# EAGLE design Test ADC (EAGLE 9.6.2)
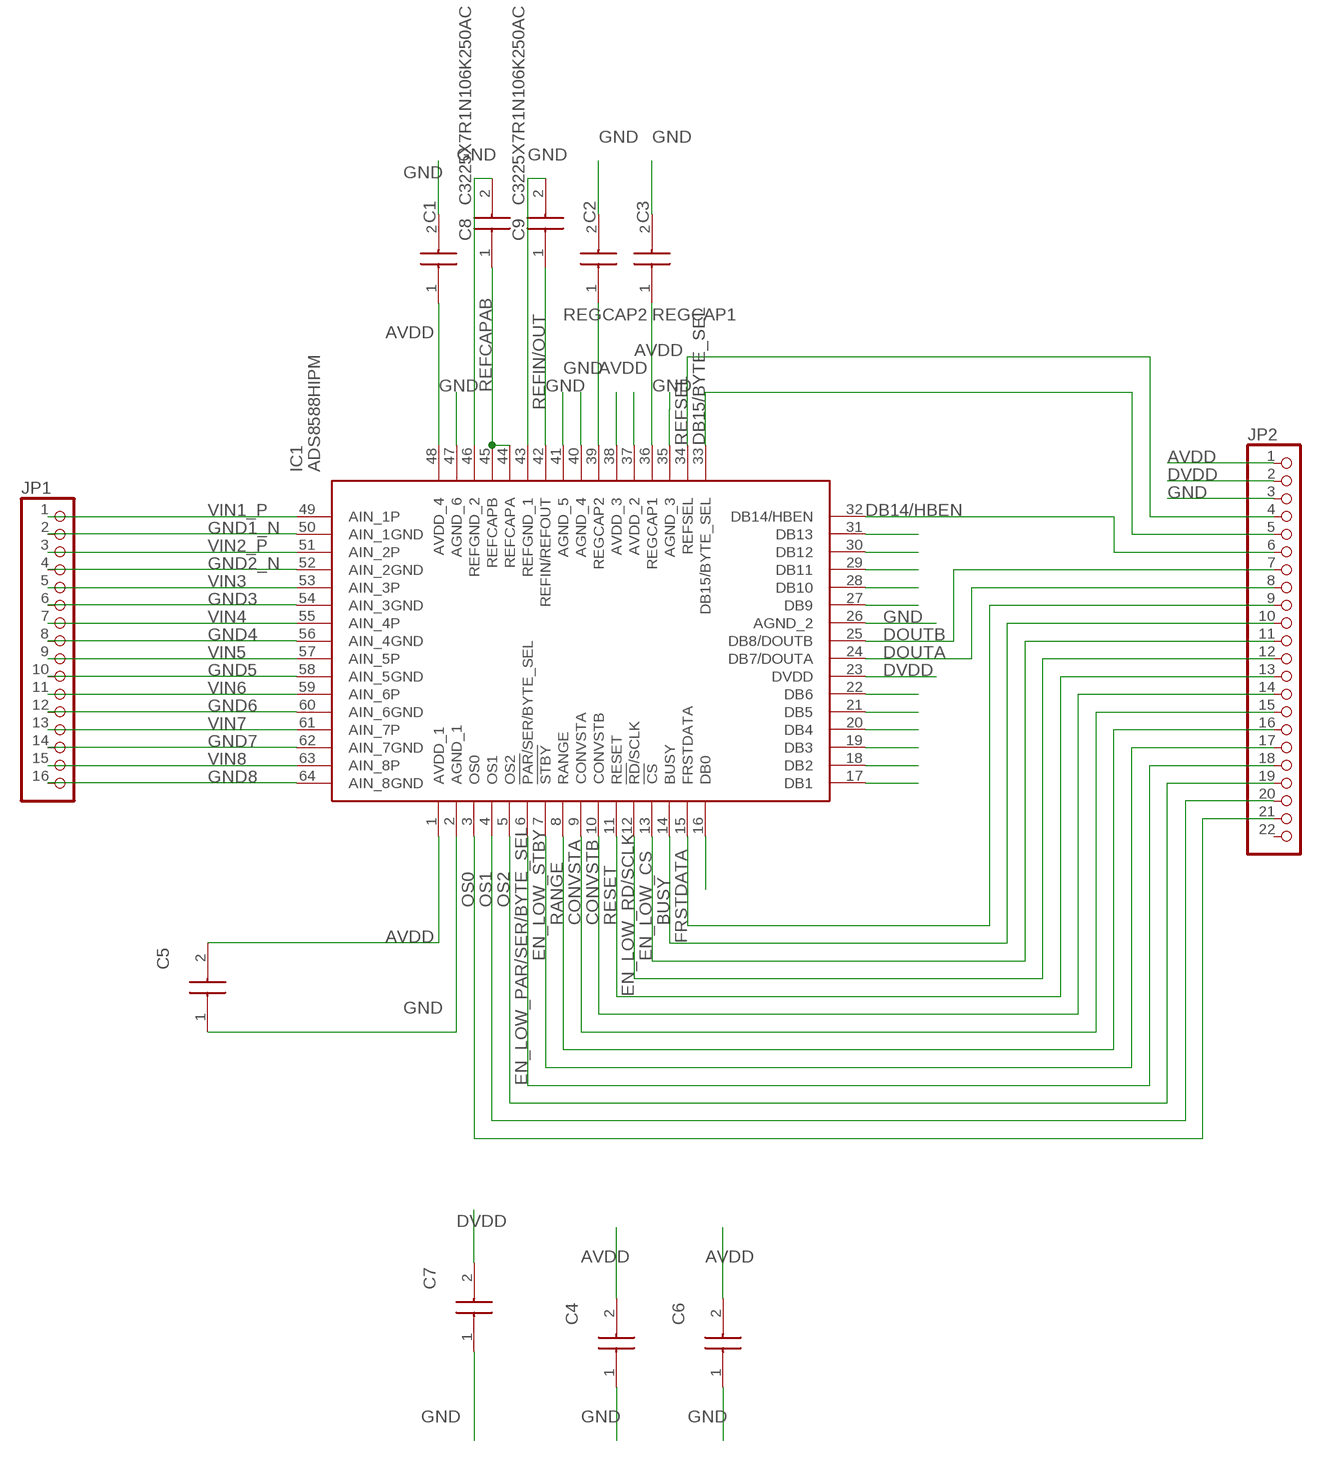
[diagram p0: schematic, sheet 1]

## Parts
C1  06033C105KAT4A  [CAPC1608X90N]
C2  06033C105KAT4A  [CAPC1608X90N]
C3  06033C105KAT4A  [CAPC1608X90N]
C4  06033C105KAT4A  [CAPC1608X90N]
C5  06033C105KAT4A  [CAPC1608X90N]
C6  06033C105KAT4A  [CAPC1608X90N]
C7  06033C105KAT4A  [CAPC1608X90N]
C8  C3225X7R1N106K250AC  [CAPC3225X230N]
C9  C3225X7R1N106K250AC  [CAPC3225X230N]
IC1  ADS8588HIPM  [QFP50P1200X1200X160-64N]
JP1  PINHD-1X16  [1X16]
JP2  PINHD-1X22  [1X22]

## Nets
AVDD: C1.1 C4.2 C5.2 C6.2 IC1.1(AVDD_1) IC1.37(AVDD_2) IC1.38(AVDD_3) IC1.48(AVDD_4) JP2.1
BUSY: IC1.14(BUSY) JP2.10
CONVSTA: IC1.9(CONVSTA) JP2.15
CONVSTB: IC1.10(CONVSTB) JP2.14
DB14/HBEN: IC1.32(DB14/HBEN) JP2.6
DB15/BYTE_SEL: IC1.33(DB15/BYTE_SEL) JP2.5
DOUTA: IC1.24(DB7/DOUTA) JP2.8
DOUTB: IC1.25(DB8/DOUTB) JP2.7
DVDD: C7.2 IC1.23(DVDD) JP2.2
EN_LOW_CS: IC1.13(!CS) JP2.11
EN_LOW_PAR/SER/BYTE_SEL: IC1.6(!PAR!/SER/BYTE_SEL) JP2.18
EN_LOW_RD/SCLK: IC1.12(!RD!/SCLK) JP2.12
EN_LOW_STBY: IC1.7(!STBY) JP2.17
FRSTDATA: IC1.15(FRSTDATA) JP2.9
GND: C1.2 C2.2 C3.2 C4.1 C5.1 C6.1 C7.1 C8.2 C9.2 IC1.2(AGND_1) IC1.26(AGND_2) IC1.35(AGND_3) IC1.40(AGND_4) IC1.41(AGND_5) IC1.43(REFGND_1) IC1.46(REFGND_2) IC1.47(AGND_6) JP2.3
GND1_N: IC1.50(AIN_1GND) JP1.2
GND2_N: IC1.52(AIN_2GND) JP1.4
GND3: IC1.54(AIN_3GND) JP1.6
GND4: IC1.56(AIN_4GND) JP1.8
GND5: IC1.58(AIN_5GND) JP1.10
GND6: IC1.60(AIN_6GND) JP1.12
GND7: IC1.62(AIN_7GND) JP1.14
GND8: IC1.64(AIN_8GND) JP1.16
N$1: IC1.31(DB13)
N$2: IC1.30(DB12)
N$3: IC1.29(DB11)
N$4: IC1.28(DB10)
N$5: IC1.27(DB9)
N$6: IC1.22(DB6)
N$7: IC1.21(DB5)
N$8: IC1.20(DB4)
N$9: IC1.19(DB3)
N$10: IC1.18(DB2)
N$11: IC1.17(DB1)
N$12: IC1.16(DB0)
OS0: IC1.3(OS0) JP2.21
OS1: IC1.4(OS1) JP2.20
OS2: IC1.5(OS2) JP2.19
RANGE: IC1.8(RANGE) JP2.16
REFCAPAB: C8.1 IC1.44(REFCAPA) IC1.45(REFCAPB)
REFIN/OUT: C9.1 IC1.42(REFIN/REFOUT)
REFSEL: IC1.34(REFSEL) JP2.4
REGCAP1: C3.1 IC1.36(REGCAP1)
REGCAP2: C2.1 IC1.39(REGCAP2)
RESET: IC1.11(RESET) JP2.13
VIN1_P: IC1.49(AIN_1P) JP1.1
VIN2_P: IC1.51(AIN_2P) JP1.3
VIN3: IC1.53(AIN_3P) JP1.5
VIN4: IC1.55(AIN_4P) JP1.7
VIN5: IC1.57(AIN_5P) JP1.9
VIN6: IC1.59(AIN_6P) JP1.11
VIN7: IC1.61(AIN_7P) JP1.13
VIN8: IC1.63(AIN_8P) JP1.15
Unconnected: JP2.22

## Library data of the parts
C1-C7 = SamacSys_Parts:06033C105KAT4A: Multilayer Ceramic Capacitors MLCC - SMD/SMT 25V 1uF X7R 0603 10%TOL Source: Datasheet <https://componentsearchengine.com/Datasheets/1/06031A100FAT2A.pdf>; DESCRIPTION: Multilayer Ceramic Capacitors MLCC - SMD/SMT 25V 1uF X7R 0603 10%TOL; HEIGHT: 0.9mm; MANUFACTURER_NAME: AVX; MANUFACTURER_PART_NUMBER: 06033C105KAT4A; MOUSER_PART_NUMBER: 581-06033C105KAT4A; MOUSER_PRICE-STOCK: https://www.mouser.co.uk/ProductDetail/AVX/06033C105KAT4A?qs=%252BdQmOuGyFcHIpI5MSreUwQ%3D%3D
C8 C9 = SamacSys_Parts:C3225X7R1N106K250AC: Multilayer Ceramic Capacitors MLCC - SMD/SMT 1210 75VDC 10uF 10% X7R Source: Datasheet <https://product.tdk.com/info/en/catalog/datasheets/mlcc_commercial_midvoltage_en.pdf>; DESCRIPTION: Multilayer Ceramic Capacitors MLCC - SMD/SMT 1210 75VDC 10uF 10% X7R; HEIGHT: 2.3mm; MANUFACTURER_NAME: TDK; MANUFACTURER_PART_NUMBER: C3225X7R1N106K250AC; MOUSER_PART_NUMBER: 810-C3225X7R1N106K25; MOUSER_PRICE-STOCK: https://www.mouser.co.uk/ProductDetail/TDK/C3225X7R1N106K250AC?qs=P1JMDcb91o5%2Fi%252BA2Vs0UoQ%3D%3D
IC1 = SamacSys_Parts:ADS8588HIPM: Analog to Digital Converters - ADC 16-Bit 500kSPS 8-Channel Simultaneous-Sampling ADC With Bipolar Inputs on a Single Supply 64-LQFP -40 to 125 Source: Datasheet <http://www.ti.com/lit/ds/symlink/ads8588h.pdf>; DESCRIPTION: Analog to Digital Converters - ADC 16-Bit 500kSPS 8-Channel Simultaneous-Sampling ADC With Bipolar Inputs on a Single Supply 64-LQFP -40 to 125; HEIGHT: 1.6mm; MANUFACTURER_NAME: Texas Instruments; MANUFACTURER_PART_NUMBER: ADS8588HIPM; MOUSER_PART_NUMBER: 595-ADS8588HIPM; MOUSER_PRICE-STOCK: https://www.mouser.co.uk/ProductDetail/Texas-Instruments/ADS8588HIPM?qs=1mbolxNpo8fD0GiY8NoIhA%3D%3D
JP1 = pinhead:PINHD-1X16: PIN HEADER
JP2 = pinhead:PINHD-1X22: PIN HEADER

## Board
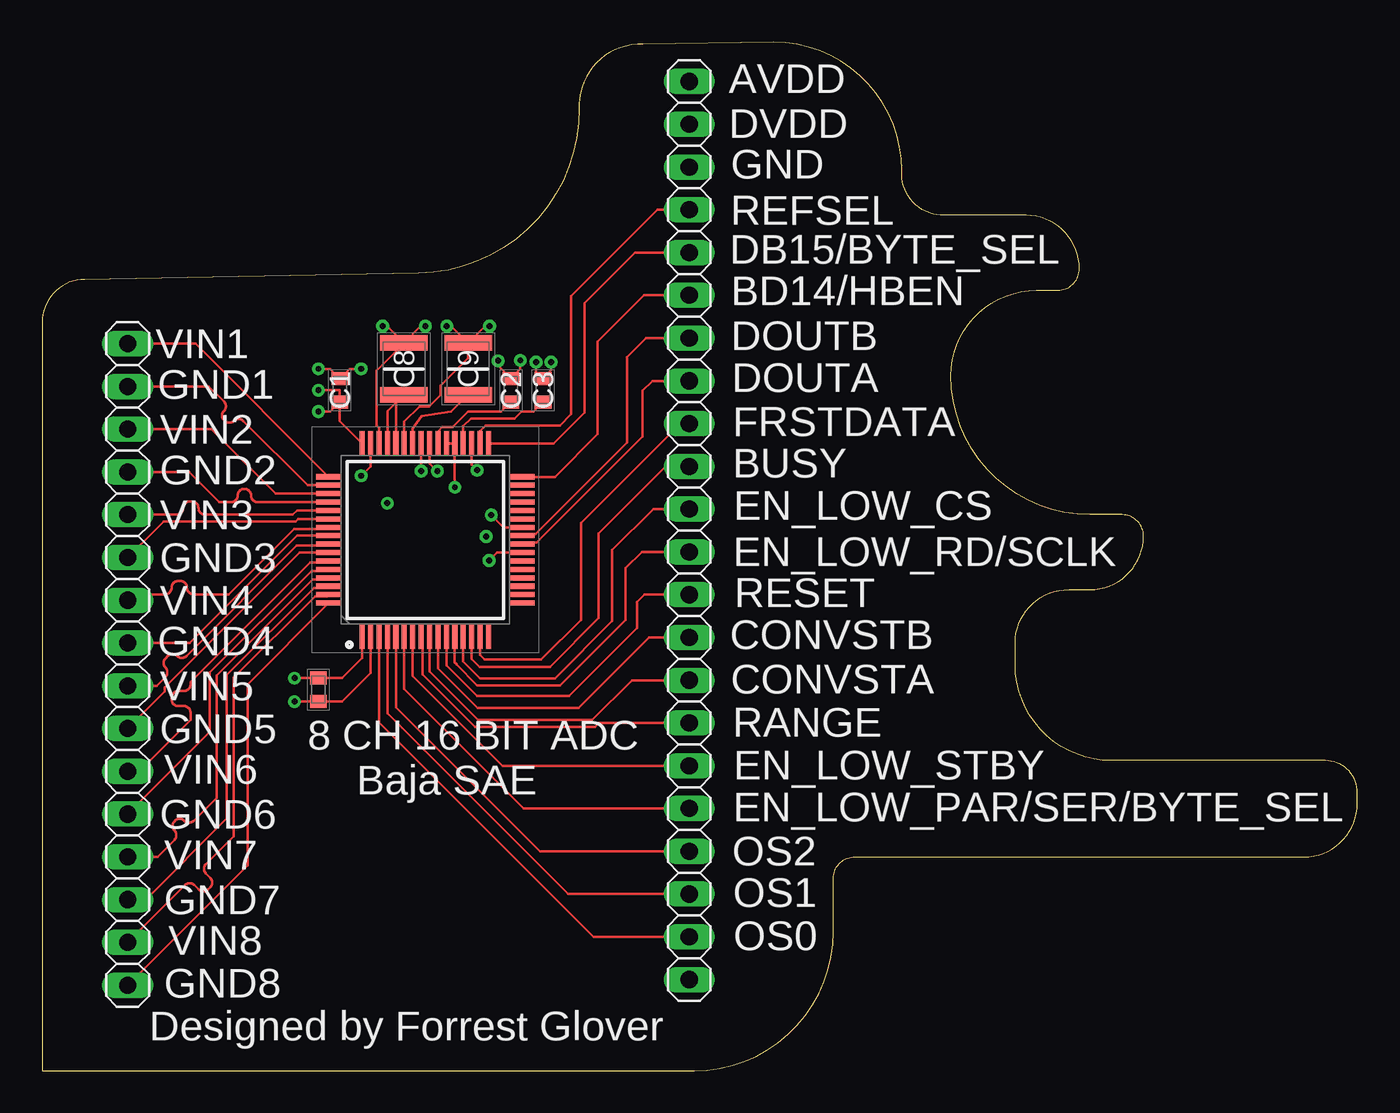
[diagram p1: board, top side]
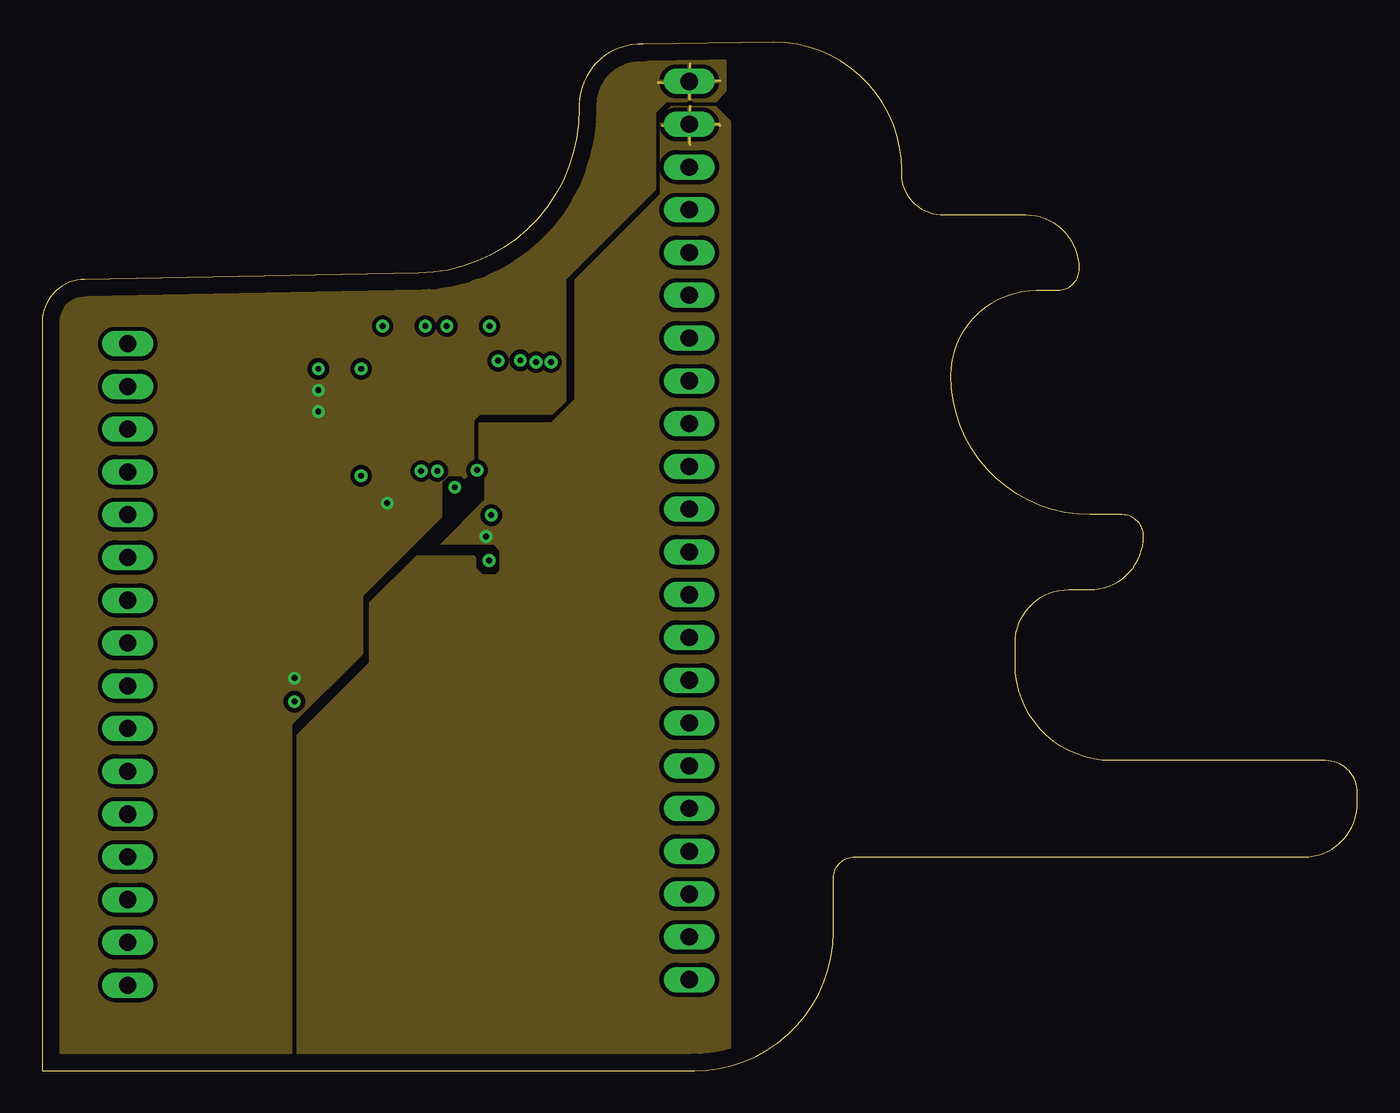
[diagram p2: board, inner layer Route2]
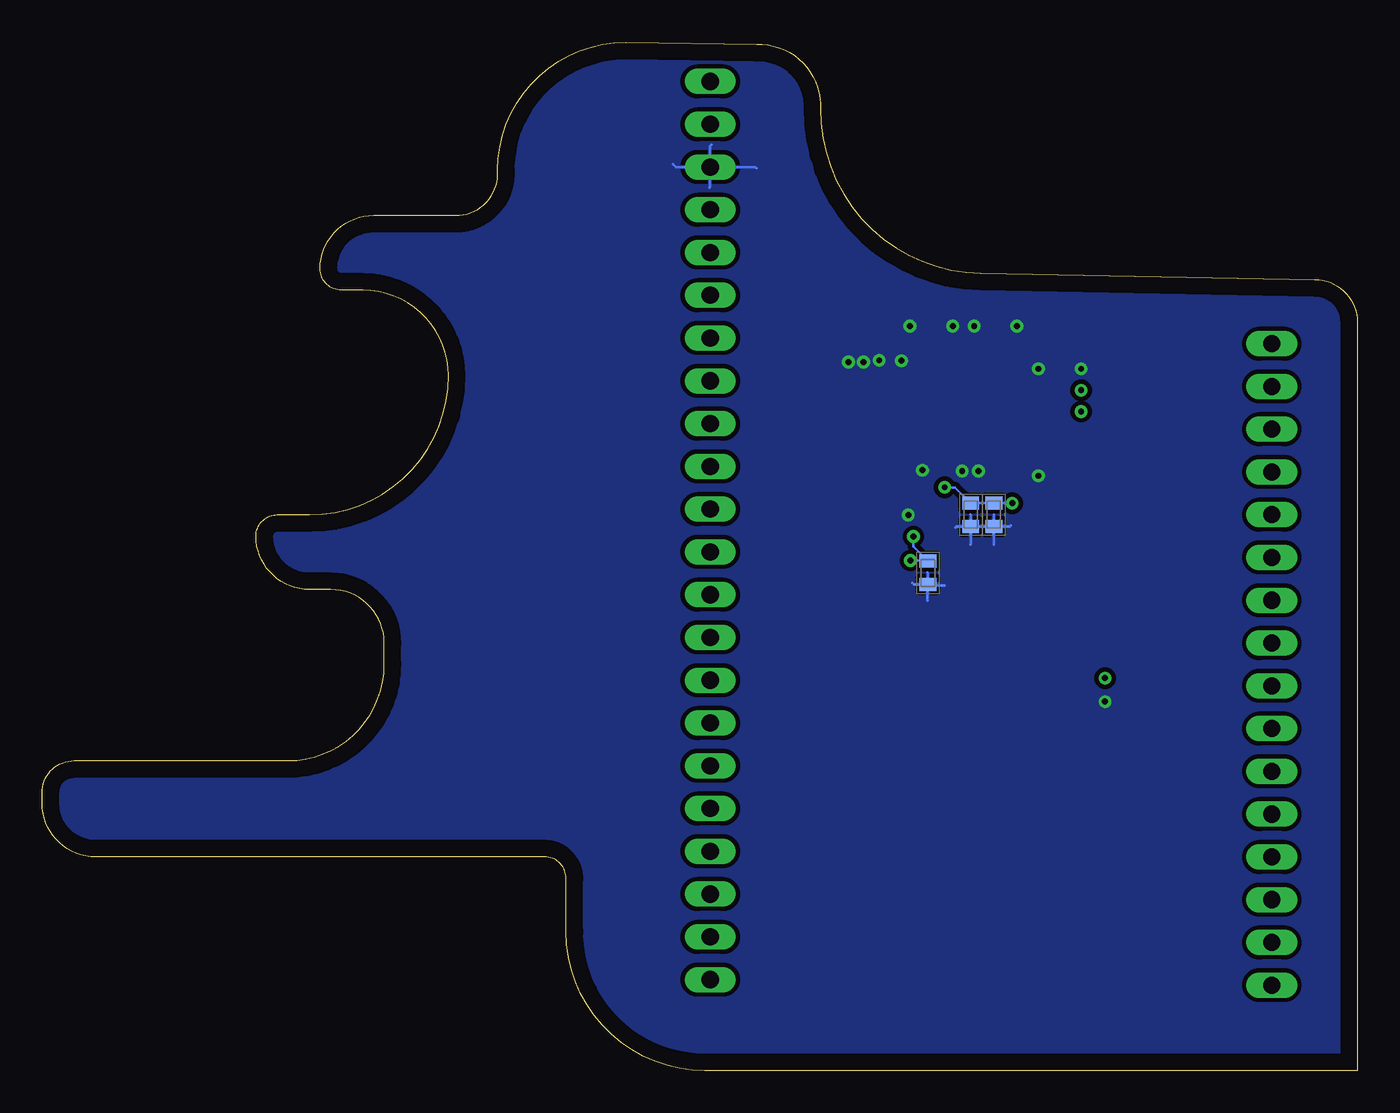
[diagram p3: board, bottom side, seen from below]

Size 78.11 x 61.09 mm. Coordinates in mm from the lower left corner, seen from the top.
Outline: 0,0 38.73,0 arc90 46.99,8.26 46.99,11.43 arc-90 48.26,12.7 74.93,12.7 arc90 78.11,15.88 78.11,16.51 arc90 76.2,18.41 63.5,18.41 arc-90 57.78,24.13 57.78,25.4 arc-90 60.96,28.57 62.23,28.57 arc90 65.41,31.75 arc90 64.14,33.02 62.23,33.02 arc-90 53.98,41.27 arc-90 59.05,46.35 60.33,46.35 arc90 61.59,47.62 arc90 58.42,50.8 53.34,50.8 arc-90 51.05,53.47 arc90 43.43,61.09 35.69,60.96 arc90 31.88,57.4 31.88,57.15 arc-90 22.35,47.37 2.54,46.99 arc90 0,44.45 0,0
Copper layers (1+2*15+16): Top 0.035mm / dielectric 0.2mm / Route2 0.035mm / dielectric 0.2mm / Route15 0.035mm / dielectric 0.2mm / Bottom 0.035mm
Design rules "default *": minimum track width 6mil, minimum drill 0.35mm, track to track 10mil, track to pad 6mil, pad to pad 6mil, via to via 6mil, smd to smd 6mil, copper to edge 40mil, drill to drill 6mil, minimum pad ring 10mil, minimum via ring 8mil, stop-mask expansion 4mil, vias tented up to drill 0mil, thermal gap 10mil

### Footprints (pad centres in the part's own frame; a part is rotated, then mirrored left to right if it is on the bottom)
CAPC1608X90N = smd 0.78 x 0.99: 1 -0.7,0; 2 0.7,0
CAPC3225X230N = smd 0.92 x 2.82: 1 -1.54,0; 2 1.54,0
QFP50P1200X1200X160-64N = smd 1.475 x 0.3: 1 -5.738,3.75; 2 -5.738,3.25; 3 -5.738,2.75; 4 -5.738,2.25; 5 -5.738,1.75; 6 -5.738,1.25; 7 -5.738,0.75; 8 -5.738,0.25; 9 -5.738,-0.25; 10 -5.738,-0.75; 11 -5.738,-1.25; 12 -5.738,-1.75; 13 -5.738,-2.25; 14 -5.738,-2.75; 15 -5.738,-3.25; 16 -5.738,-3.75; 33 5.738,-3.75; 34 5.738,-3.25; 35 5.738,-2.75; 36 5.738,-2.25; 37 5.738,-1.75; 38 5.738,-1.25; 39 5.738,-0.75; 40 5.738,-0.25; 41 5.738,0.25; 42 5.738,0.75; 43 5.738,1.25; 44 5.738,1.75; 45 5.738,2.25; 46 5.738,2.75; 47 5.738,3.25; 48 5.738,3.75 | smd 0.3 x 1.475: 17 -3.75,-5.738; 18 -3.25,-5.738; 19 -2.75,-5.738; 20 -2.25,-5.738; 21 -1.75,-5.738; 22 -1.25,-5.738; 23 -0.75,-5.738; 24 -0.25,-5.738; 25 0.25,-5.738; 26 0.75,-5.738; 27 1.25,-5.738; 28 1.75,-5.738; 29 2.25,-5.738; 30 2.75,-5.738; 31 3.25,-5.738; 32 3.75,-5.738; 49 3.75,5.738; 50 3.25,5.738; 51 2.75,5.738; 52 2.25,5.738; 53 1.75,5.738; 54 1.25,5.738; 55 0.75,5.738; 56 0.25,5.738; 57 -0.25,5.738; 58 -0.75,5.738; 59 -1.25,5.738; 60 -1.75,5.738; 61 -2.25,5.738; 62 -2.75,5.738; 63 -3.25,5.738; 64 -3.75,5.738
1X16 = drill 1.016 long: 1 -19.05,0; 2 -16.51,0; 3 -13.97,0; 4 -11.43,0; 5 -8.89,0; 6 -6.35,0; 7 -3.81,0; 8 -1.27,0; 9 1.27,0; 10 3.81,0; 11 6.35,0; 12 8.89,0; 13 11.43,0; 14 13.97,0; 15 16.51,0; 16 19.05,0
1X22 = drill 1.016 long: 1 -26.67,0; 2 -24.13,0; 3 -21.59,0; 4 -19.05,0; 5 -16.51,0; 6 -13.97,0; 7 -11.43,0; 8 -8.89,0; 9 -6.35,0; 10 -3.81,0; 11 -1.27,0; 12 1.27,0; 13 3.81,0; 14 6.35,0; 15 8.89,0; 16 11.43,0; 17 13.97,0; 18 16.51,0; 19 19.05,0; 20 21.59,0; 21 24.13,0; 22 26.67,0

### Placement (x,y rotation side)
C1  17.68,40.41 90 top
C2  27.84,40.41 90 top
C3  29.74,40.41 90 top
C4  22.96,33.02 90 bottom
C5  16.41,22.63 90 top
C6  21.59,33.02 90 bottom
C7  25.5,29.57 90 bottom
C8  21.49,41.68 90 top
C9  25.3,41.68 90 top
IC1  22.76,31.52 90 top
JP1  5.08,24.13 270 top
JP2  38.43,32.08 270 top

### Tracks (layer width: path | path; a pad name or v marks a point on that pad's centre or on a via)
AVDD  (via drill 0.35)
  Top 0.152: IC1.48 17.68,38.59 C1.1 | C1.1 17.11,39.14 v16.41,39.14 | C1.1 17.68,40.41 v16.41,40.41 | IC1.38 IC1.37 v24.51,34.65 | IC1.1 19.01,24.52 17.82,23.33 C5.2 v15,23.33 v14.99,23.32
  Route2 0.152: 38.48,58.8 40.26,58.8 | JP2.1 38.48,58.8 | 38.48,58.8 38.48,59.82 | JP2.1 38.35,58.67 36.58,58.67 | JP2.1 38.43,57.73 38.48,57.68
  Bottom 0.152: v20.5,33.71 20.51,33.72 C6.2 C4.2 23.89,34.65 v24.51,34.65
  pour Route2: 40.64,62.48 40.64,58.17 40.01,57.53 37.08,57.53 36.45,56.9 36.45,52.32 31.11,46.99 31.11,39.75 30.32,38.96 26,38.96 25.65,38.61 25.65,35.69 25.15,35.18 25.02,35.18 24.89,35.31 24.13,35.31 23.75,34.92 23.75,32.89 19.05,28.19 19.05,24.77 14.86,20.57 14.86,-0.89 -1.02,-0.89 -1.52,-0.38 -1.52,46.74 14.35,62.61 40.64,62.61 40.77,62.48 40.77,62.1
BUSY
  Top 0.152: IC1.14 25.51,24.45 25.98,23.98 30.15,23.98 33.05,26.87 33.05,31.9 37.03,35.89 JP2.10
CONVSTA
  Top 0.152: IC1.9 23.01,23.7 25.88,20.83 32.66,20.83 35.03,23.19 JP2.15
CONVSTB
  Top 0.152: IC1.10 23.51,23.89 25.86,21.54 31.85,21.54 36.04,25.73 JP2.14
DB14/HBEN
  Top 0.152: IC1.32 28.83,35.27 29.3,35.27 30.45,35.27 32.99,37.82 32.99,43.31 35.74,46.05 JP2.6
DB15/BYTE_SEL
  Top 0.152: IC1.33 30.38,37.26 32.21,39.09 32.21,45.59 35.2,48.59 JP2.5
DOUTA
  Top 0.152: IC1.24 28.59,31.36 29.38,31.36 35.66,37.65 35.66,40.39 36.25,40.97 JP2.8
DOUTB
  Top 0.152: IC1.25 28.59,31.86 29.3,31.86 34.75,37.31 34.75,42.39 35.87,43.51 JP2.7
DVDD  (via drill 0.35)
  Top 0.152: IC1.23 27.01,30.77 v26.54,30.3
  Route2 0.152: JP2.2 40.18,56.21 40.26,56.13 | JP2.2 38.43,55.04 38.48,54.99 | JP2.2 38.35,56.13 36.83,56.13 | JP2.2 38.48,56.26 38.48,57.28
  Bottom 0.152: v26.36,31.73 26.36,31.13 C7.2 25.54,30.3 v26.54,30.3
  pour Route2: 37.34,57.28 40.01,57.28 40.89,56.39 40.89,0.51 15.11,0.51 15.11,19.94 19.43,24.26 19.43,27.81 22.23,30.61 25.65,30.61 25.78,30.48 25.78,29.84 26.16,29.46 26.92,29.46 27.18,29.72 27.18,30.86 26.8,31.24 23.62,31.24 26.29,33.91 26.29,35.94 25.91,36.32 25.91,38.48 30.23,38.48 31.62,39.88 31.62,46.99 36.7,52.07 36.7,56.64
EN_LOW_CS
  Top 0.152: IC1.13 25.01,24.29 26.01,23.29 30.45,23.29 33.86,26.7 33.86,30.91 36.3,33.35 JP2.11
EN_LOW_PAR/SER/BYTE_SEL
  Top 0.152: JP2.18 28.6,15.57 21.51,22.66 IC1.6
EN_LOW_RD/SCLK
  Top 0.152: IC1.12 24.51,24.26 24.6,24.17 24.6,24.12 25.84,22.89 30.76,22.89 34.65,26.77 34.65,29.84 35.61,30.81 JP2.12
EN_LOW_STBY
  Top 0.152: IC1.7 22.01,23.46 27.36,18.11 JP2.17
FRSTDATA
  Top 0.152: IC1.15 26.01,24.69 26.29,24.41 29.64,24.41 32,26.77 32,32.54 37.9,38.43 JP2.9
GND  (via drill 0.35)
  Top 0.152: v18.95,41.68 18.25,41.68 C1.2 17.11,41.68 v16.41,41.68 | C8.2 20.49,44.22 v20.22,44.22 | C8.2 22.49,44.22 v22.76,44.22 | C9.2 24.3,44.22 v24.03,44.22 | C9.2 26.3,44.22 v26.57,44.22 | IC1.47 19.51,35.89 v18.95,35.33 | C8.2 19.85,41.58 19.85,38.32 20.01,38.16 IC1.46 | IC1.43 21.51,38.55 22.4,39.45 22.99,39.45 23.66,40.12 23.66,40.7 25.3,42.34 C9.2 | v30.23,42.09 30.23,41.59 C3.2 29.34,41.52 v29.34,42.09 | IC1.41 v22.51,35.62 v22.5,35.61 | IC1.40 23.01,36.07 v23.47,35.61 | IC1.35 25.51,35.98 v25.83,35.66 | IC1.2 19.51,23.62 17.82,21.93 C5.1 15,21.93 v14.99,21.92 | v27.08,42.16 27.08,41.87 C2.2 28.4,41.67 v28.4,42.19 | IC1.26 27.39,32.27 v26.67,32.99
  Bottom 0.152: C6.1 21.59,31.24 | C4.1 22.96,31.27 22.99,31.24 | C7.1 25.53,28.84 25.53,27.94 | C6.1 20.64,32.32 20.57,32.38 | C6.1 21.59,32.38 | 21.59,32.38 21.59,33.02 | C4.1 22.96,32.99 22.99,33.02 | C4.1 21.66,32.32 21.59,32.38 | C4.1 23.81,32.32 23.88,32.26 | C7.1 25.46,28.83 24.51,28.83 | C7.1 25.5,29.57 25.53,29.59 | C7.1 26.33,28.87 26.42,28.96 | JP2.3 40.46,53.67 40.64,53.85 | JP2.3 38.43,54.91 38.35,54.99 | JP2.3 35.76,53.67 35.69,53.59 | JP2.3 38.43,52.5 38.48,52.45
  pour Bottom: -3.17,65.28 70.23,65.28 80.39,55.12 80.39,0.25 76.2,-3.94 -5.59,-3.94 -5.59,62.61 -3.05,65.15
GND1_N
  Top 0.152: JP1.2 9.91,40.64 10.8,39.74 arc-90 10.8,39.19 arc90 10.8,38.63 10.84,38.59 arc90 11.39,38.59 arc-90 11.95,38.59 15.78,34.77 IC1.50
GND2_N
  Top 0.152: IC1.52 12.8,33.77 arc-90 12.41,34.16 arc90 12.01,34.56 12.01,34.56 arc90 11.62,34.16 arc-90 11.22,33.77 10.53,33.77 8.74,35.56 JP1.4
GND3
  Top 0.152: IC1.54 15.88,32.77 15.21,32.77 15.05,32.61 7.21,32.61 JP1.6
GND4
  Top 0.152: IC1.56 15.14,31.77 8.77,25.4 JP1.8
GND5
  Top 0.152: JP1.10 7.28,22.52 7.28,22.75 15.29,30.77 IC1.58
GND6
  Top 0.152: JP1.12 9.96,20.12 9.96,23.64 15.99,29.68 16.93,29.68 IC1.60
GND7
  Top 0.152: JP1.14 6.15,10.16 10.97,14.99 10.97,23.51 16.14,28.68 16.93,28.68 IC1.62
GND8
  Top 0.152: IC1.64 12.19,22.94 12.19,12.19 JP1.16
OS0
  Top 0.152: IC1.3 20.01,20.68 32.74,7.95 JP2.21
OS1
  Top 0.152: IC1.4 20.51,21.22 31.24,10.49 JP2.20
OS2
  Top 0.152: IC1.5 21.01,21.59 29.57,13.03 JP2.19
RANGE
  Top 0.152: IC1.8 22.6,25.69 22.6,23.53 25.71,20.42 32.83,20.42 33.06,20.65 JP2.16
REFCAPAB
  Top 0.152: IC1.45 20.51,39.16 C8.1 21.01,39.66 IC1.44
REFIN/OUT
  Top 0.152: IC1.42 22.01,38.14 22.53,38.89 24.3,39.14 C9.1
REFSEL
  Top 0.152: IC1.34 26.01,38 26.34,38.33 30.76,38.33 31.42,38.99 31.42,46 36.55,51.13 JP2.4
REGCAP1
  Top 0.152: IC1.36 25.01,38.28 25.47,38.73 28.07,38.73 28.48,39.14 29.17,39.14 C3.1
REGCAP2
  Top 0.152: IC1.39 23.51,37.97 23.76,38.23 24.38,38.23 25.3,39.14 27.27,39.14 C2.1
RESET
  Top 0.152: IC1.11 24.01,24.07 25.83,22.25 31.29,22.25 35.33,26.29 35.33,27.84 35.76,28.27 JP2.13
VIN1_P
  Top 0.152: IC1.49 9.11,43.18 JP1.1
VIN2_P
  Top 0.152: JP1.3 10.03,38.1 13.86,34.27 IC1.51
VIN3
  Top 0.152: JP1.5 7.98,33.02 arc90 8.38,33.41 arc-90 8.77,33.81 8.89,33.81 arc-90 9.28,33.41 arc90 9.68,33.02 14.88,33.02 15.14,33.27 IC1.53
VIN4
  Top 0.152: IC1.55 16.93,32.18 14.97,32.18 11.09,28.3 8.99,28.3 arc-90 8.6,28.69 arc90 8.2,29.08 8.09,29.08 arc90 7.69,28.69 arc-90 7.3,28.3 5.44,28.3 JP1.7
VIN5
  Top 0.152: IC1.57 16.93,31.18 15.12,31.18 8.57,24.62 arc-90 8.02,24.62 arc90 7.46,24.62 7.33,24.49 arc90 7.33,23.94 arc-90 7.33,23.38 6.81,22.86 JP1.9
VIN6
  Top 0.152: IC1.59 16.93,30.18 15.92,30.18 8.81,23.07 8.81,22.94 arc-90 8.42,22.54 8.08,22.54 arc90 7.68,22.15 7.68,22.05 arc90 8.08,21.66 8.42,21.66 arc-90 8.81,21.27 8.81,20.83 5.77,17.78 JP1.11
VIN7
  Top 0.152: IC1.61 16.93,29.18 16.07,29.18 10.36,23.47 10.36,16.2 9,14.85 arc-90 8.45,14.85 arc90 7.89,14.85 7.86,14.82 arc90 7.86,14.26 arc-90 7.86,13.7 6.86,12.7 JP1.13
VIN8
  Top 0.152: IC1.63 16.93,28.18 16.22,28.18 11.38,23.34 11.38,13.92 9.73,12.27 arc90 9.73,11.71 9.98,11.46 arc-90 9.98,10.9 9.85,10.77 arc-90 9.3,10.77 9.04,11.02 arc90 8.48,11.02 JP1.15

### Text on the board
tPlace: AVDD | DVDD | GND | VIN1 | GND1 | VIN2 | GND2 | VIN3 | GND3 | VIN4 | GND4 | VIN5 | GND5 | 8 CH 16 BIT ADC | VIN6 | Baja SAE | GND6 | VIN7 | GND7 | VIN8 | GND8 | Designed by Forrest Glover
tNames: REFSEL | DB15/BYTE_SEL | BD14/HBEN | DOUTB | DOUTA | FRSTDATA | BUSY | EN_LOW_CS | EN_LOW_RD/SCLK | RESET | CONVSTB | CONVSTA | RANGE | EN_LOW_STBY | EN_LOW_PAR/SER/BYTE_SEL | OS2 | OS1 | OS0